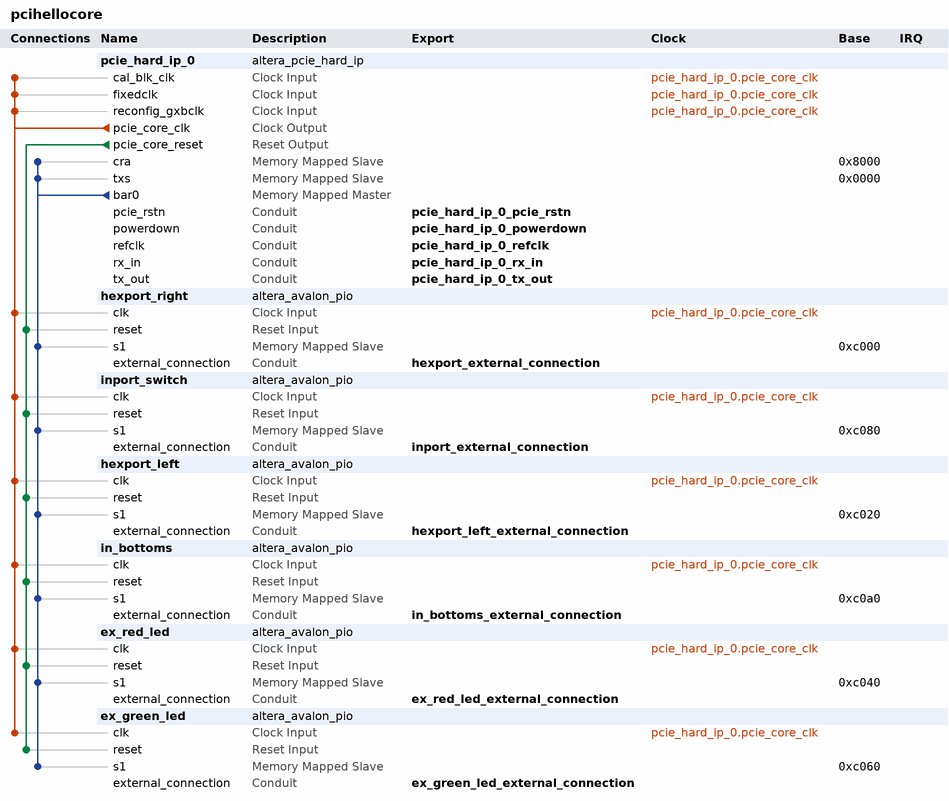
[diagram p0: system contents]
# Platform Designer (Qsys) system pcihellocore, Cyclone IV GX EP4CGX150DF31C7
# Parameters at their usual value, and those the tool derives, are not listed.
package require -exact qsys 17.1
create_system pcihellocore
set_project_property DEVICE_FAMILY {Cyclone IV GX}
set_project_property DEVICE EP4CGX150DF31C7

add_instance pcie_hard_ip_0 altera_pcie_hard_ip 17.1
set_instance_parameter_value pcie_hard_ip_0 {BAR Type} {32 bit Non-Prefetchable,Not used,Not used,Not used,Not used,Not used}
set_instance_parameter_value pcie_hard_ip_0 CB_A2P_ADDR_MAP_PASS_THRU_BITS 15
set_instance_parameter_value pcie_hard_ip_0 CG_ENABLE_A2P_INTERRUPT 0
set_instance_parameter_value pcie_hard_ip_0 CG_NO_CPL_REORDERING 0
set_instance_parameter_value pcie_hard_ip_0 {PCIe Address 31:0} 0x00000000,0x00000000,0x00000000,0x00000000,0x00000000,0x00000000,0x00000000,0x00000000,0x00000000,0x00000000,0x00000000,0x00000000,0x00000000,0x00000000,0x00000000,0x00000000
set_instance_parameter_value pcie_hard_ip_0 {PCIe Address 63:32} 0x00000000,0x00000000,0x00000000,0x00000000,0x00000000,0x00000000,0x00000000,0x00000000,0x00000000,0x00000000,0x00000000,0x00000000,0x00000000,0x00000000,0x00000000,0x00000000
set_instance_parameter_value pcie_hard_ip_0 class_code 0
set_instance_parameter_value pcie_hard_ip_0 device_id 4
set_instance_parameter_value pcie_hard_ip_0 my_advanced_errors false
set_instance_parameter_value pcie_hard_ip_0 my_enable_ecrc_check false
set_instance_parameter_value pcie_hard_ip_0 my_enable_ecrc_gen false
set_instance_parameter_value pcie_hard_ip_0 p_pcie_app_clk 1
set_instance_parameter_value pcie_hard_ip_0 p_pcie_test_out_width None
set_instance_parameter_value pcie_hard_ip_0 p_user_msi_enable 0
set_instance_parameter_value pcie_hard_ip_0 subsystem_device_id 4
set_instance_parameter_value pcie_hard_ip_0 subsystem_vendor_id 4466
set_instance_parameter_value pcie_hard_ip_0 vendor_id 4466

add_instance hexport_right altera_avalon_pio 17.1
set_instance_parameter_value hexport_right direction Output
set_instance_parameter_value hexport_right resetValue 1077952576
set_instance_parameter_value hexport_right width 32

add_instance inport_switch altera_avalon_pio 17.1
set_instance_parameter_value inport_switch direction Input
set_instance_parameter_value inport_switch width 16

add_instance hexport_left altera_avalon_pio 17.1
set_instance_parameter_value hexport_left direction Output
set_instance_parameter_value hexport_left resetValue 1077952576
set_instance_parameter_value hexport_left width 32

add_instance in_bottoms altera_avalon_pio 17.1
set_instance_parameter_value in_bottoms direction Input
set_instance_parameter_value in_bottoms width 32

add_instance ex_red_led altera_avalon_pio 17.1
set_instance_parameter_value ex_red_led direction Output
set_instance_parameter_value ex_red_led width 32

add_instance ex_green_led altera_avalon_pio 17.1
set_instance_parameter_value ex_green_led direction Output
set_instance_parameter_value ex_green_led width 32

# connections
add_connection pcie_hard_ip_0.pcie_core_clk ex_green_led.clk clock
add_connection pcie_hard_ip_0.pcie_core_clk ex_red_led.clk clock
add_connection pcie_hard_ip_0.pcie_core_clk hexport_left.clk clock
add_connection pcie_hard_ip_0.pcie_core_clk hexport_right.clk clock
add_connection pcie_hard_ip_0.pcie_core_clk in_bottoms.clk clock
add_connection pcie_hard_ip_0.pcie_core_clk inport_switch.clk clock
add_connection pcie_hard_ip_0.pcie_core_clk pcie_hard_ip_0.cal_blk_clk clock
add_connection pcie_hard_ip_0.pcie_core_clk pcie_hard_ip_0.fixedclk clock
add_connection pcie_hard_ip_0.pcie_core_clk pcie_hard_ip_0.reconfig_gxbclk clock
add_connection pcie_hard_ip_0.pcie_core_reset ex_green_led.reset reset
add_connection pcie_hard_ip_0.pcie_core_reset ex_red_led.reset reset
add_connection pcie_hard_ip_0.pcie_core_reset hexport_left.reset reset
add_connection pcie_hard_ip_0.pcie_core_reset hexport_right.reset reset
add_connection pcie_hard_ip_0.pcie_core_reset in_bottoms.reset reset
add_connection pcie_hard_ip_0.pcie_core_reset inport_switch.reset reset
add_connection pcie_hard_ip_0.bar0 ex_green_led.s1 avalon
set_connection_parameter_value pcie_hard_ip_0.bar0/ex_green_led.s1 baseAddress 0xc060
add_connection pcie_hard_ip_0.bar0 ex_red_led.s1 avalon
set_connection_parameter_value pcie_hard_ip_0.bar0/ex_red_led.s1 baseAddress 0xc040
add_connection pcie_hard_ip_0.bar0 hexport_left.s1 avalon
set_connection_parameter_value pcie_hard_ip_0.bar0/hexport_left.s1 baseAddress 0xc020
add_connection pcie_hard_ip_0.bar0 hexport_right.s1 avalon
set_connection_parameter_value pcie_hard_ip_0.bar0/hexport_right.s1 baseAddress 0xc000
add_connection pcie_hard_ip_0.bar0 in_bottoms.s1 avalon
set_connection_parameter_value pcie_hard_ip_0.bar0/in_bottoms.s1 baseAddress 0xc0a0
add_connection pcie_hard_ip_0.bar0 inport_switch.s1 avalon
set_connection_parameter_value pcie_hard_ip_0.bar0/inport_switch.s1 baseAddress 0xc080
add_connection pcie_hard_ip_0.bar0 pcie_hard_ip_0.cra avalon
set_connection_parameter_value pcie_hard_ip_0.bar0/pcie_hard_ip_0.cra baseAddress 0x8000
add_connection pcie_hard_ip_0.bar0 pcie_hard_ip_0.txs avalon
set_connection_parameter_value pcie_hard_ip_0.bar0/pcie_hard_ip_0.txs baseAddress 0x0000

# exported interfaces
add_interface ex_green_led_external_connection conduit end
set_interface_property ex_green_led_external_connection EXPORT_OF ex_green_led.external_connection
add_interface ex_red_led_external_connection conduit end
set_interface_property ex_red_led_external_connection EXPORT_OF ex_red_led.external_connection
add_interface hexport_external_connection conduit end
set_interface_property hexport_external_connection EXPORT_OF hexport_right.external_connection
add_interface hexport_left_external_connection conduit end
set_interface_property hexport_left_external_connection EXPORT_OF hexport_left.external_connection
add_interface in_bottoms_external_connection conduit end
set_interface_property in_bottoms_external_connection EXPORT_OF in_bottoms.external_connection
add_interface inport_external_connection conduit end
set_interface_property inport_external_connection EXPORT_OF inport_switch.external_connection
add_interface pcie_hard_ip_0_pcie_rstn conduit end
set_interface_property pcie_hard_ip_0_pcie_rstn EXPORT_OF pcie_hard_ip_0.pcie_rstn
add_interface pcie_hard_ip_0_powerdown conduit end
set_interface_property pcie_hard_ip_0_powerdown EXPORT_OF pcie_hard_ip_0.powerdown
add_interface pcie_hard_ip_0_refclk conduit end
set_interface_property pcie_hard_ip_0_refclk EXPORT_OF pcie_hard_ip_0.refclk
add_interface pcie_hard_ip_0_rx_in conduit end
set_interface_property pcie_hard_ip_0_rx_in EXPORT_OF pcie_hard_ip_0.rx_in
add_interface pcie_hard_ip_0_tx_out conduit end
set_interface_property pcie_hard_ip_0_tx_out EXPORT_OF pcie_hard_ip_0.tx_out

set_interconnect_requirement {$system} qsys_mm.clockCrossingAdapter HANDSHAKE
set_interconnect_requirement {$system} qsys_mm.maxAdditionalLatency 1

save_system pcihellocore.qsys
